# EasyEDA Pro project ProDoc_XC7K35T_GTP_USB_Core_LiteRevB.1.brd_2025-10-08.epro, schematic EA3059_4CH_BUCK_CBB
Board Name: EA3059_4CH_BUCK_CBB; Create Date: 2025-05-20; Page Name: P1; Project Name: XC7A35TCSG325_USB3_Demo; Schematic Name: EA3059_4CH_BUCK_CBB; Update Date: 2025-05-31; Company: Design By A.W.; Drawed: Design By A.W.; Page Size: A3; Reviewed: Review By A.W.; Version: V1.0
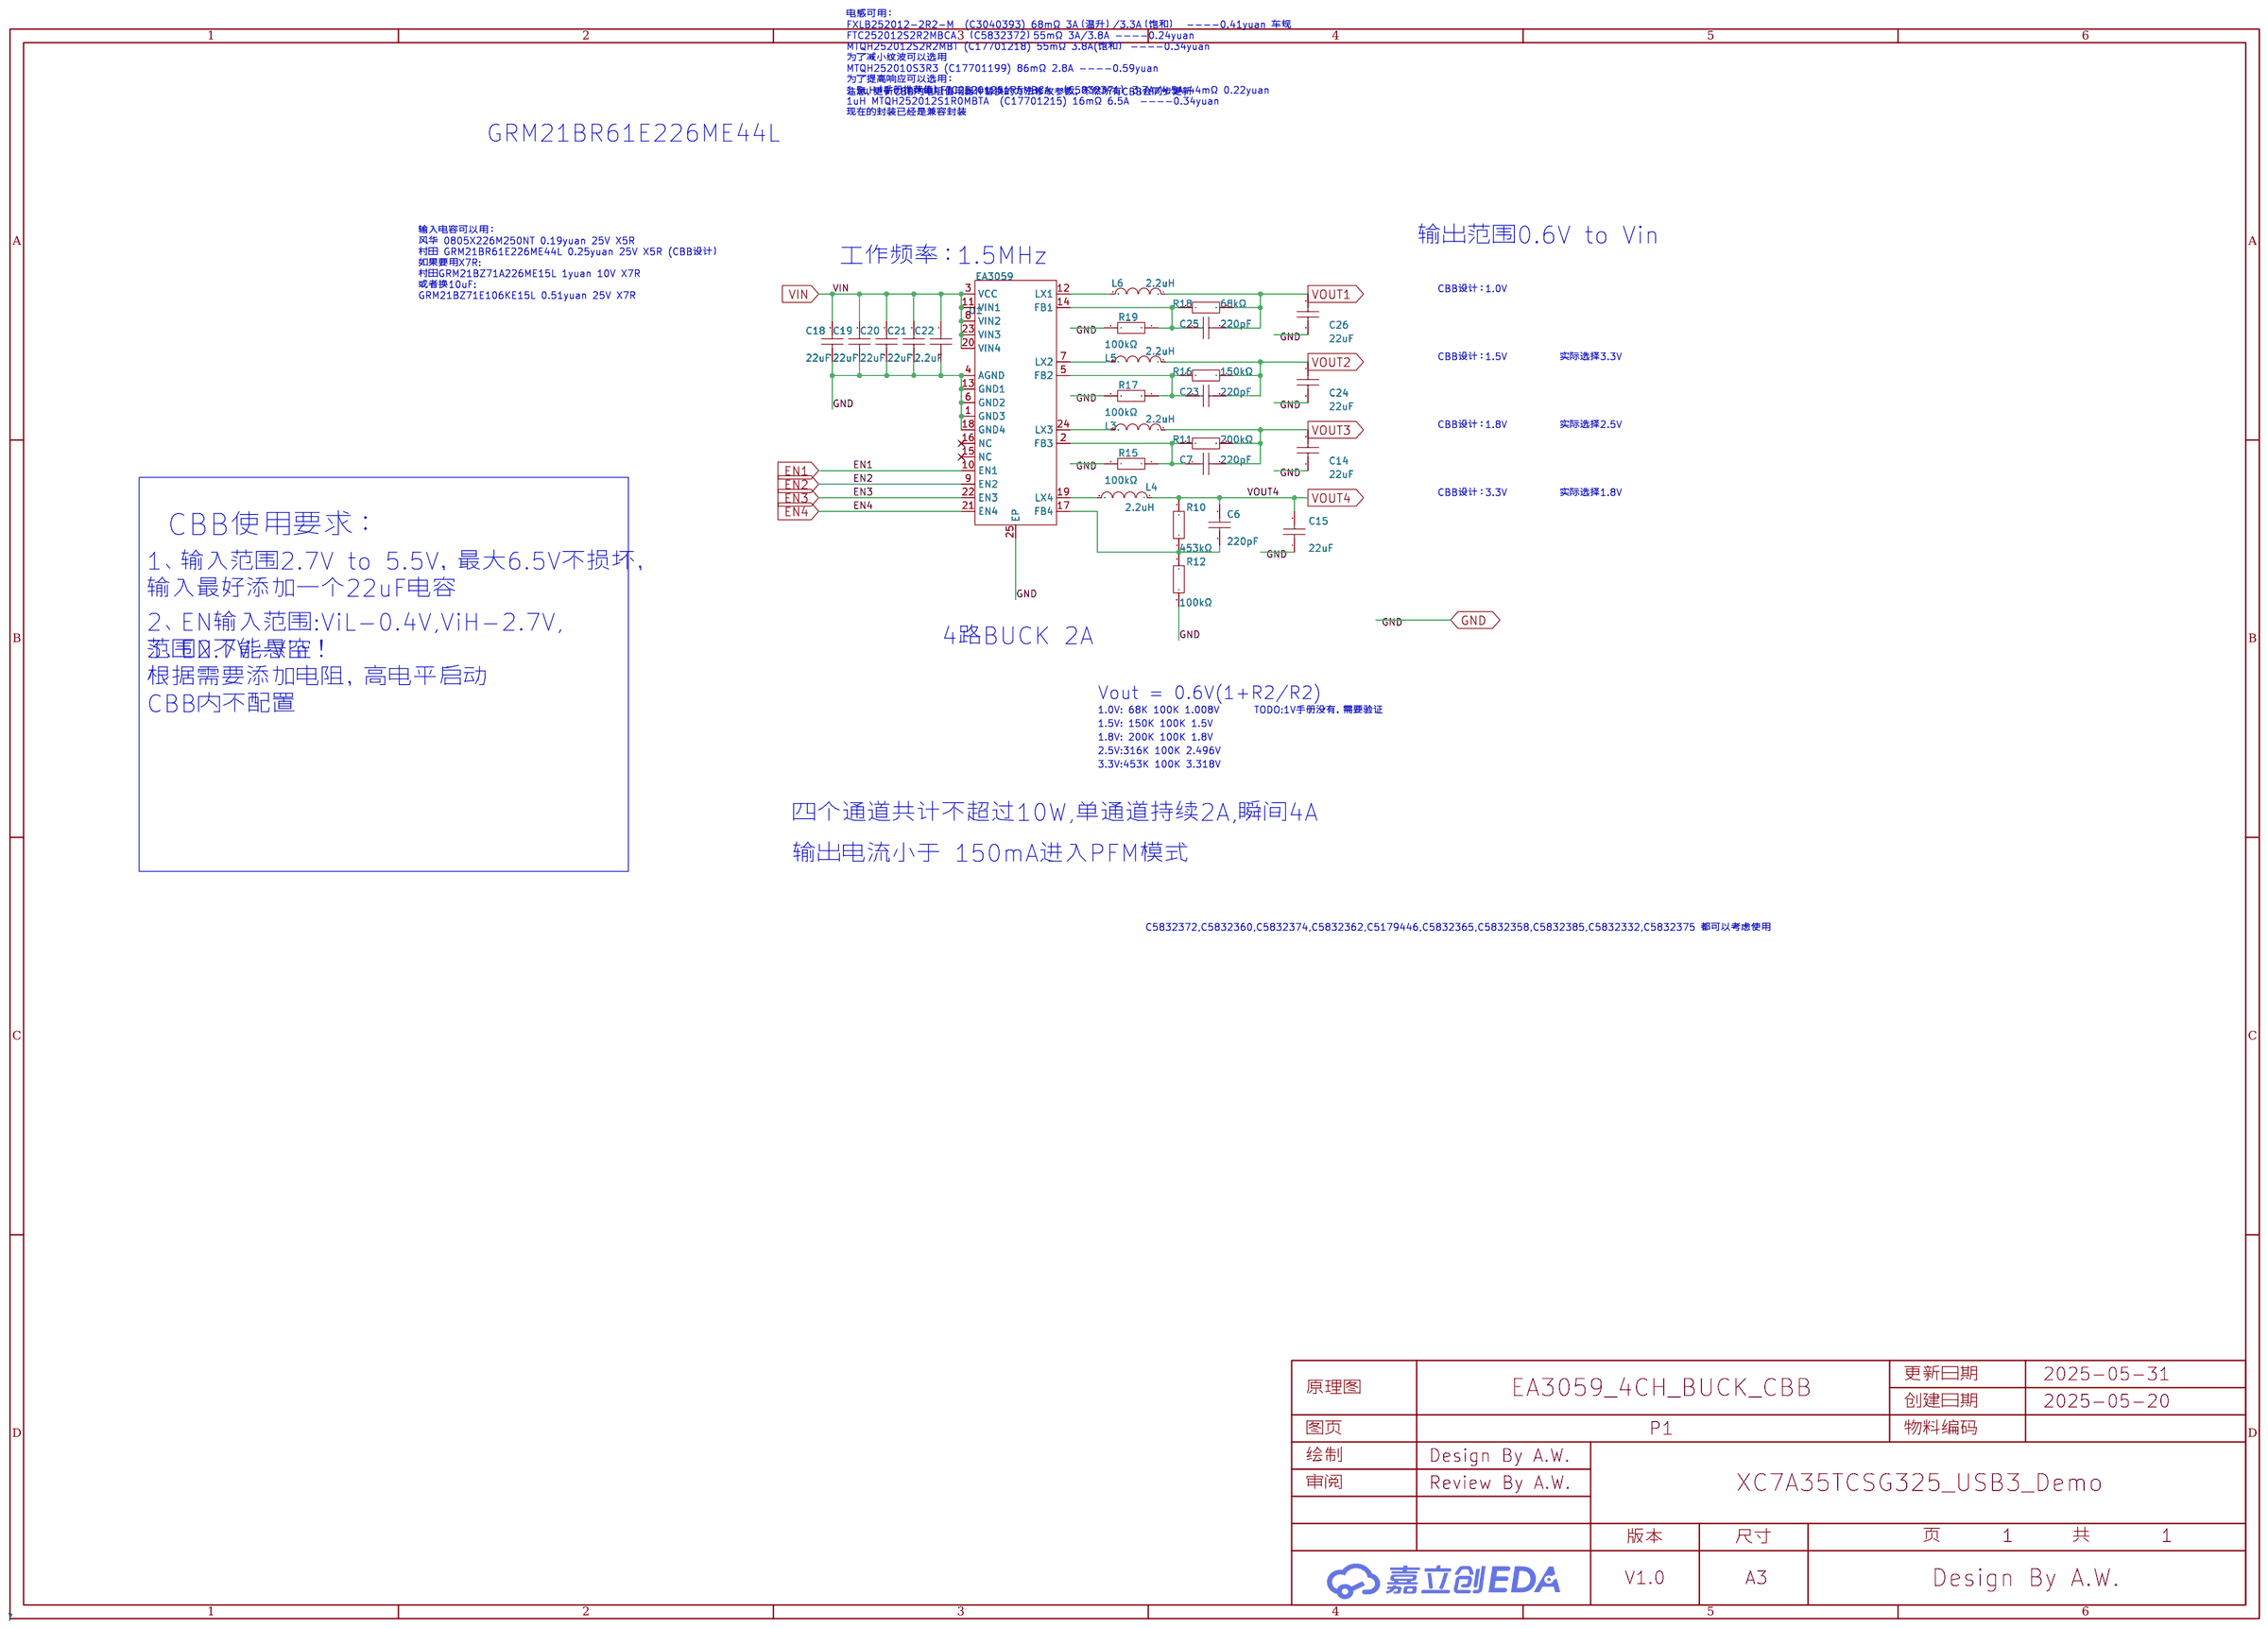
[diagram p11: schematic sheet]

## Parts
C6  220pF  [C0402_1005M_S]
C7  220pF  [C0402_1005M_S]
C14  22uF  [C0805_2012M_S]
C15  22uF  [C0805_2012M_S]
C18  22uF  [C0603_1608M_S]
C19  22uF  [C0603_1608M_S]
C20  22uF  [C0603_1608M_S]
C21  22uF  [C0603_1608M_S]
C22  2.2uF  [C0402_1005M_S]
C23  220pF  [C0402_1005M_S]
C24  22uF  [C0805_2012M_S]
C25  220pF  [C0402_1005M_S]
C26  22uF  [C0805_2012M_S]
L3  2.2uH  [IND-SMD_L2.5-W2.0-L2520M]
L4  2.2uH  [IND-SMD_L2.5-W2.0-L2520M]
L5  2.2uH  [IND-SMD_L2.5-W2.0-L2520M]
L6  2.2uH  [IND-SMD_L2.5-W2.0-L2520M]
R10  453kΩ  [R0402_1005M_S]
R11  200kΩ  [R0402_1005M_S]
R12  100kΩ  [R0402_1005M_S]
R15  100kΩ  [R0402_1005M_S]
R16  150kΩ  [R0402_1005M_S]
R17  100kΩ  [R0402_1005M_S]
R18  68kΩ  [R0402_1005M_S]
R19  100kΩ  [R0402_1005M_S]
U1  EA3059  [VQFN-24_L4.0-W4.0-P0.50-TL-EP2.5]

## Library data of the parts
C6 C7 C23 C25 = 0402B221K500NT: 容值:220pF;精度:±10%;额定电压:50V;材质(温度系数):X7R;; LCSC Part Name: 220pF ±10% 50V; Supplier Part: C1530; Manufacturer: FH(风华); Supplier Footprint: 0402; JLCPCB Part Class: Basic Part; Datasheet: https://atta.szlcsc.com/upload/public/pdf/source/20200305/C486355_26A10D38EF8C2A5C37091D0039909270.pdf; Supplier: LCSC; Tolerance: ±10%; Voltage Rated: 50V; Temperature Coefficient: X7R
C14 C15 C24 C26 = GRM21BR61E226ME44L: 容值:22uF;精度:±20%;额定电压:25V;材质(温度系数):X5R;; LCSC Part Name: 22uF ±20% 25V; Supplier Part: C86816; Manufacturer: muRata(村田); Supplier Footprint: 0805; JLCPCB Part Class: 扩展库; Datasheet: https://atta.szlcsc.com/upload/public/pdf/source/20161226/1482720145536.pdf; Supplier: LCSC; Tolerance: ±20%; Voltage Rated: 25V; Temperature Coefficient: X5R
C18-C21 = GRM188R61A226ME15D: 容值:22uF;精度:±20%;额定电压:10V;材质(温度系数):X5R;; LCSC Part Name: 22uF ±20% 10V; Supplier Part: C84419; Manufacturer: muRata(村田); Supplier Footprint: 0603; JLCPCB Part Class: Extended Part; Datasheet: https://atta.szlcsc.com/upload/public/pdf/source/20161024/1477288637384.pdf; Supplier: LCSC; Tolerance: ±20%; Voltage Rated: 10V; Temperature Coefficient: X5R
C22 = GRM155R61A225KE95D: 容值:2.2uF;精度:±10%;额定电压:10V;材质(温度系数):X5R;; LCSC Part Name: 2.2uF ±10% 10V; Supplier Part: C77002; Manufacturer: muRata(村田); Supplier Footprint: 0402; JLCPCB Part Class: Extended Part; Datasheet: https://atta.szlcsc.com/upload/public/pdf/source/20180326/C77002_D35CAAF23EAD1FF71F41A67C7E29E1B2.pdf; Supplier: LCSC; Tolerance: ±10%; Voltage Rated: 10V; Temperature Coefficient: X5R
L3-L6 = FXLB252012-2R2-M: 电感值:2.2uH;精度:±20%;额定电流:3A;类型:一体成型电感;饱和电流(Isat):3.3A;; LCSC Part Name: 2.2uH ±20% 3.3A; Supplier Part: C3040393; Manufacturer: cjiang(长江微电); Supplier Footprint: SMD,2.5x2.0x1.2mm; JLCPCB Part Class: 扩展库; Datasheet: https://atta.szlcsc.com/upload/public/pdf/source/20220812/975CD70F8F8BB72DF45FA36D37878048.pdf; Supplier: LCSC; Tolerance: ±20%; Rated Current: 3A; Type: 一体成型电感; DC Resistance (DCR): 68mΩ; Saturation Current (Isat): 3.3A; Ratings: AEC-Q200
R10 = AC0402FR-07453KL: 电阻类型:厚膜电阻;阻值:453kΩ;精度:±1%;功率:62.5mW;最大工作电压:50V;温度系数:±100ppm/℃;; LCSC Part Name: 厚膜电阻 453kΩ ±1% 62.5mW; Supplier Part: C227088; Manufacturer: YAGEO(国巨); Supplier Footprint: 0402; JLCPCB Part Class: Extended Part; Datasheet: https://atta.szlcsc.com/upload/public/pdf/source/20180927/C229861_4ABDC471507C1ED6AFB4BA66AFC8620A.pdf; Supplier: LCSC; Type: 厚膜电阻; Tolerance: ±1%; Power(Watts): 62.5mW; Overload Voltage (Max): 50V; Temperature Coefficient: ±100ppm/℃; Operating Temperature Range: -55℃~+155℃
R11 = 0402WGF2003TCE: 电阻类型:厚膜电阻;阻值:200kΩ;精度:±1%;功率:62.5mW;最大工作电压:50V;温度系数:±100ppm/℃;; LCSC Part Name: 200kΩ ±1% 62.5mW 厚膜电阻; Supplier Part: C25764; Manufacturer: UNI-ROYAL(厚声); Supplier Footprint: 0402; JLCPCB Part Class: Basic Part; Datasheet: https://atta.szlcsc.com/upload/public/pdf/source/20200306/C422600_1E6D84923E4A46A82E41ADD87F860B5C.pdf; Supplier: LCSC; Type: 厚膜电阻; Tolerance: ±1%; Power(Watts): 62.5mW; Overload Voltage (Max): 50V; Temperature Coefficient: ±100ppm/℃; Operating Temperature Range: -55℃~+155℃
R12 R15 R17 R19 = 0402WGF1003TCE: 电阻类型:厚膜电阻;阻值:100kΩ;精度:±1%;功率:62.5mW;最大工作电压:50V;温度系数:±100ppm/℃;; LCSC Part Name: 100kΩ ±1% 62.5mW 厚膜电阻; Supplier Part: C25741; Manufacturer: UNI-ROYAL(厚声); Supplier Footprint: 0402; JLCPCB Part Class: Basic Part; Datasheet: https://atta.szlcsc.com/upload/public/pdf/source/20200306/C422600_1E6D84923E4A46A82E41ADD87F860B5C.pdf; Supplier: LCSC; Type: 厚膜电阻; Tolerance: ±1%; Power(Watts): 62.5mW; Overload Voltage (Max): 50V; Temperature Coefficient: ±100ppm/℃; Operating Temperature Range: -55℃~+155℃
R16 = 0402WGF1503TCE: 电阻类型:厚膜电阻;阻值:150kΩ;精度:±1%;功率:62.5mW;最大工作电压:50V;温度系数:±100ppm/℃;; LCSC Part Name: 150kΩ ±1% 62.5mW 厚膜电阻; Supplier Part: C25755; Manufacturer: UNI-ROYAL(厚声); Supplier Footprint: 0402; JLCPCB Part Class: Extended Part; Datasheet: https://atta.szlcsc.com/upload/public/pdf/source/20200306/C422600_1E6D84923E4A46A82E41ADD87F860B5C.pdf; Supplier: LCSC; Type: 厚膜电阻; Tolerance: ±1%; Power(Watts): 62.5mW; Overload Voltage (Max): 50V; Temperature Coefficient: ±100ppm/℃; Operating Temperature Range: -55℃~+155℃
R18 = 0402WGF6802TCE: 电阻类型:厚膜电阻;阻值:68kΩ;精度:±1%;功率:62.5mW;最大工作电压:50V;温度系数:±100ppm/℃;; LCSC Part Name: 68kΩ ±1% 62.5mW 厚膜电阻; Supplier Part: C36871; Manufacturer: UNI-ROYAL(厚声); Supplier Footprint: 0402; JLCPCB Part Class: Extended Part; Datasheet: https://atta.szlcsc.com/upload/public/pdf/source/20200306/C422600_1E6D84923E4A46A82E41ADD87F860B5C.pdf; Supplier: LCSC; Type: 厚膜电阻; Tolerance: ±1%; Power(Watts): 62.5mW; Overload Voltage (Max): 50V; Temperature Coefficient: ±100ppm/℃; Operating Temperature Range: -55℃~+155℃
U1 = EA3059: 电源电压:2.7V~5.5V;输出电压：0.6V-Vin;电流2A,4A peak; Supplier: LCSC; Manufacturer: everanalog(申风); Supplier Part: C111586; JLCPCB Part Class: 扩展库; Supplier Footprint: QFN-24-EP(4x4); Supply Voltage: 2.7V~5.5V; Number of Cells: 4

## Nets
GND: C14.2 C15.1 C18.1 C19.1 C20.1 C21.1 C22.1 C24.2 C26.2 R12.1 R15.2 R17.2 R19.2 U1.1(GND3) U1.4(AGND) U1.6(GND2) U1.13(GND1) U1.18(GND4) U1.25(EP)
VIN: C18.2 C19.2 C20.2 C21.2 C22.2 U1.3(VCC) U1.8(VIN2) U1.11(VIN1) U1.20(VIN4) U1.23(VIN3)
EN1: U1.10(EN1)
EN2: U1.9(EN2)
EN3: U1.22(EN3)
EN4: U1.21(EN4)
VOUT1: C25.2 C26.1 L6.1 R18.1
VOUT2: C23.2 C24.1 L5.1 R16.1
VOUT3: C7.2 C14.1 L3.1 R11.1
VOUT4: C6.2 C15.2 L4.2 R10.2
$1N807: L3.2 U1.24(LX3)
$1N809: L4.1 U1.19(LX4)
$1N1163: C6.1 R10.1 R12.2 U1.17(FB4)
$1N9621: C7.1 R11.2 R15.1 U1.2(FB3)
$1N9972: L5.2 U1.7(LX2)
$1N9975: C23.1 R16.2 R17.1 U1.5(FB2)
$1N10203: L6.2 U1.12(LX1)
$1N10206: C25.1 R18.2 R19.1 U1.14(FB1)

Not connected (* = marked no-connect by the designer): U1 15(NC)* 16(NC)*

## Notes on the sheet
- 注意，更新CBB内电阻值用器件替换的方法修改参数，不然所有CBB会同步更新
- 电感可用：
  FXLB252012-2R2-M  (C3040393) 68mΩ 3A（温升）/3.3A（饱和）  ----0.41yuan 车规
  FTC252012S2R2MBCA  （C5832372）55mΩ 3A/3.8A ----0.24yuan
  MTQH252012S2R2MBT (C17701218) 55mΩ 3.8A(饱和） ----0.34yuan
  为了减小纹波可以选用
  MTQH252010S3R3 (C17701199) 86mΩ 2.8A ----0.59yuan
  为了提高响应可以选用：
  1.5uH（手册推荐值）FTC252012S1R5MBCA  （C5832371） 3.7A/4.5A 44mΩ 0.22yuan
  1uH MTQH252012S1R0MBTA  (C17701215) 16mΩ 6.5A  ----0.34yuan
  现在的封装已经是兼容封装
- GRM21BR61E226ME44L
- 输出范围0.6V to Vin
- 工作频率：1.5MHz
- 输入电容可以用：
  风华 0805X226M250NT 0.19yuan 25V X5R
  村田 GRM21BR61E226ME44L 0.25yuan 25V X5R (CBB设计）
  如果要用X7R:
  村田GRM21BZ71A226ME15L 1yuan 10V X7R
  或者换10uF:
  GRM21BZ71E106KE15L 0.51yuan 25V X7R
- CBB设计：1.0V
- CBB设计：1.5V
- 实际选择3.3V
- CBB设计：1.8V
- 实际选择2.5V
- CBB设计：3.3V
- 实际选择1.8V
- CBB使用要求：
- 1、输入范围2.7V to 5.5V，最大6.5V不损坏，
  输入最好添加一个22uF电容
- 4路BUCK 2A
- 2、EN输入范围:ViL-0.4V,ViH-2.7V,
  范围2.7V-Vin
- Vout = 0.6V(1+R2/R2)
- 3、EN不能悬空！
  根据需要添加电阻，高电平启动
  CBB内不配置
- 1.0V: 68K 100K 1.008V
- TODO:1V手册没有，需要验证
- 1.5V: 150K 100K 1.5V
- 1.8V: 200K 100K 1.8V
- 2.5V:316K 100K 2.496V
- 3.3V:453K 100K 3.318V
- 四个通道共计不超过10W,单通道持续2A,瞬间4A
- 输出电流小于 150mA进入PFM模式
- C5832372,C5832360,C5832374,C5832362,C5179446,C5832365,C5832358,C5832385,C5832332,C5832375 都可以考虑使用
